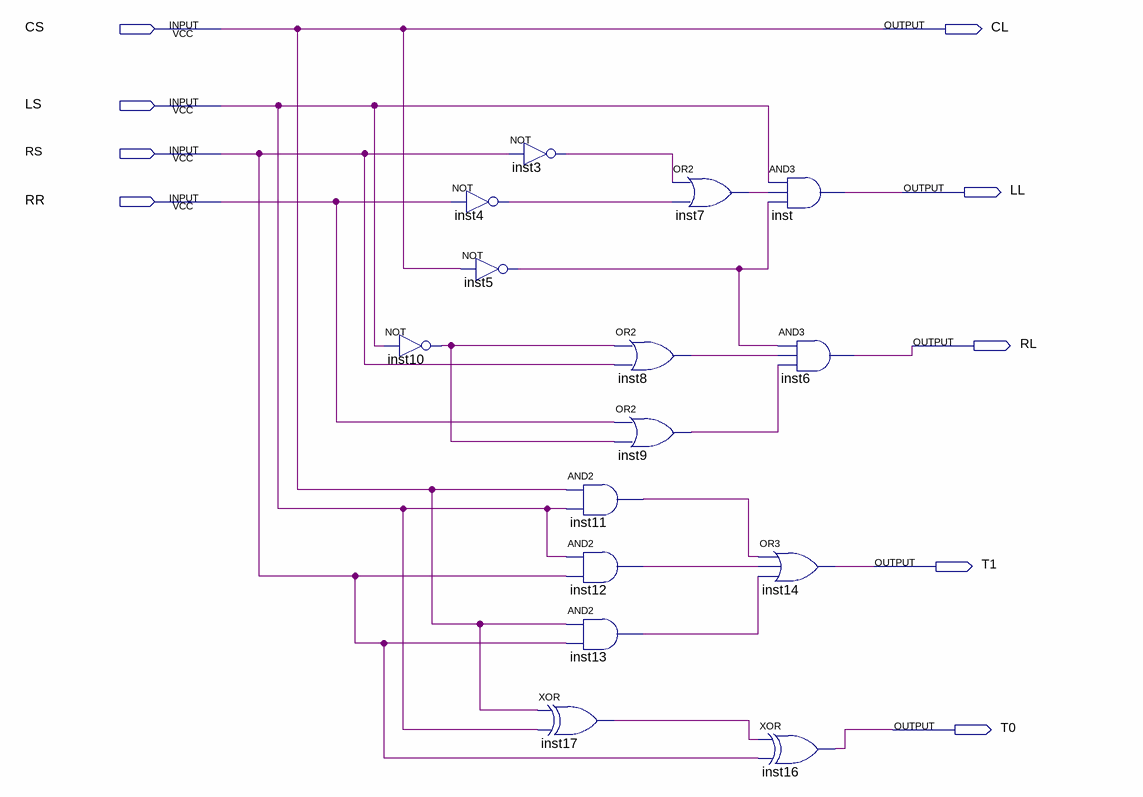
[diagram p0: schematic sheet]
// Quartus schematic Lab3.bdf as structural Verilog: 15 symbols, 9 pins
module Lab3 (
  input  CS,
  input  LS,
  input  RS,
  input  RR,
  output CL,
  output LL,
  output RL,
  output T1,
  output T0
);

  wire inst3_out, inst4_out, inst5_out, inst7_out, inst8_out, inst9_out, inst10_out, inst11_out, inst12_out,
       inst13_out, inst17_out;

  not inst10 (inst10_out, LS);
  not inst4 (inst4_out, RR);
  not inst5 (inst5_out, CS);
  not inst3 (inst3_out, RS);
  and inst11 (inst11_out, CS, LS);
  and inst12 (inst12_out, LS, RS);
  and inst13 (inst13_out, CS, RS);
  xor inst17 (inst17_out, CS, LS);
  or inst8 (inst8_out, inst10_out, RS);
  or inst9 (inst9_out, RR, inst10_out);
  or inst7 (inst7_out, inst3_out, inst4_out);
  and inst (LL, LS, inst7_out, inst5_out);
  and inst6 (RL, inst5_out, inst8_out, inst9_out);
  or inst14 (T1, inst11_out, inst12_out, inst13_out);
  xor inst16 (T0, inst17_out, RS);

  assign CL = CS;
endmodule
